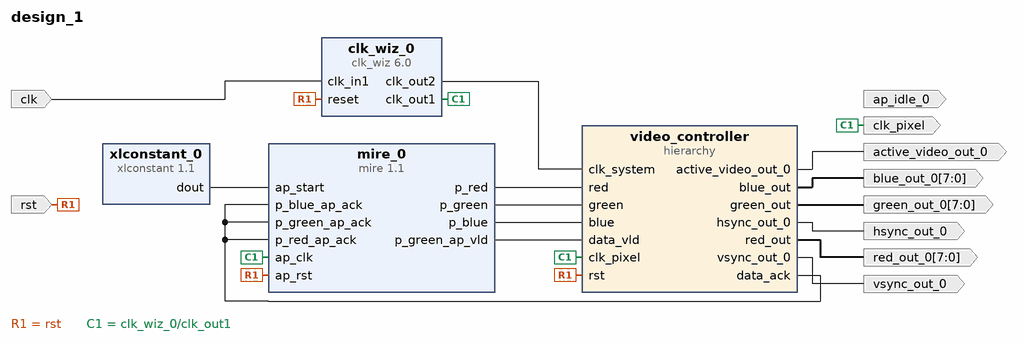
[diagram p0: block diagram of the top level]
# Vivado block design design_1, xc7z020clg484-1, Vivado 2019.2
create_bd_design design_1

create_bd_port -dir I rst
create_bd_port -dir I clk
create_bd_port -dir O vsync_out_0
create_bd_port -dir O hsync_out_0
create_bd_port -dir O -from 7 -to 0 red_out_0
create_bd_port -dir O -from 7 -to 0 green_out_0
create_bd_port -dir O -from 7 -to 0 blue_out_0
create_bd_port -dir O active_video_out_0
create_bd_port -dir O ap_idle_0
create_bd_port -dir O clk_pixel

create_bd_cell -type ip -vlnv xilinx.com:ip:clk_wiz:6.0 clk_wiz_0
set_property -dict [list \
  CONFIG.CLKOUT1_JITTER 191.399 \
  CONFIG.CLKOUT1_PHASE_ERROR 114.212 \
  CONFIG.CLKOUT1_REQUESTED_OUT_FREQ 25.200 \
  CONFIG.CLKOUT2_JITTER 144.719 \
  CONFIG.CLKOUT2_PHASE_ERROR 114.212 \
  CONFIG.CLKOUT2_REQUESTED_OUT_FREQ 100.000 \
  CONFIG.CLKOUT2_USED true \
  CONFIG.MMCM_CLKFBOUT_MULT_F 8.000 \
  CONFIG.MMCM_CLKOUT0_DIVIDE_F 31.750 \
  CONFIG.MMCM_CLKOUT1_DIVIDE 8 \
  CONFIG.MMCM_DIVCLK_DIVIDE 1 \
  CONFIG.NUM_OUT_CLKS 2 \
] [get_bd_cells clk_wiz_0]
create_bd_cell -type hier video_controller
create_bd_cell -type ip -vlnv xilinx.com:hls:mire:1.1 mire_0
create_bd_cell -type ip -vlnv xilinx.com:ip:xlconstant:1.1 xlconstant_0

# ---- hierarchy /video_controller ----
current_bd_instance /video_controller
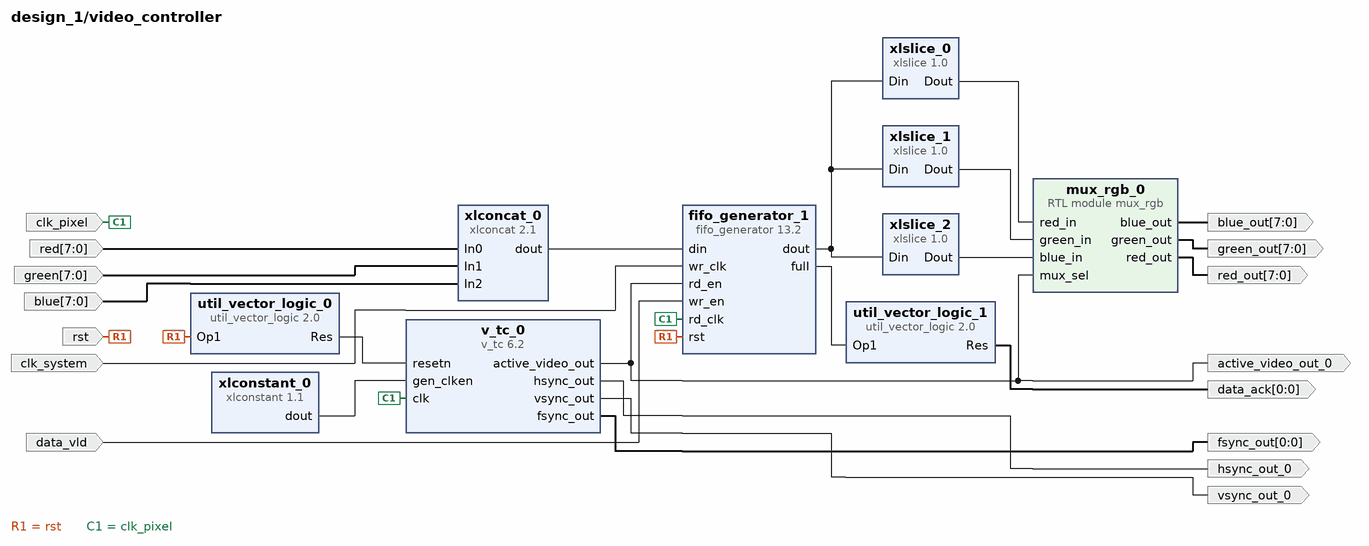
[diagram p1: block diagram inside /video_controller]
create_bd_pin -dir I -from 7 -to 0 red
create_bd_pin -dir I -from 7 -to 0 green
create_bd_pin -dir I -from 7 -to 0 blue
create_bd_pin -dir I rst
create_bd_pin -dir O -from 0 -to 0 data_ack
create_bd_pin -dir I -type clk clk_pixel
create_bd_pin -dir O hsync_out_0
create_bd_pin -dir O vsync_out_0
create_bd_pin -dir O active_video_out_0
create_bd_pin -dir O -from 0 -to 0 fsync_out
create_bd_pin -dir I -type clk clk_system
create_bd_pin -dir I data_vld
create_bd_pin -dir O -from 7 -to 0 red_out
create_bd_pin -dir O -from 7 -to 0 green_out
create_bd_pin -dir O -from 7 -to 0 blue_out

create_bd_cell -type ip -vlnv xilinx.com:ip:xlconcat:2.1 xlconcat_0
set_property -dict [list \
  CONFIG.IN0_WIDTH 8 \
  CONFIG.IN1_WIDTH 8 \
  CONFIG.IN2_WIDTH 8 \
  CONFIG.NUM_PORTS 3 \
  CONFIG.dout_width 24 \
] [get_bd_cells xlconcat_0]
create_bd_cell -type ip -vlnv xilinx.com:ip:util_vector_logic:2.0 util_vector_logic_0
set_property -dict {CONFIG.C_OPERATION not CONFIG.C_SIZE 1} [get_bd_cells util_vector_logic_0]
create_bd_cell -type ip -vlnv xilinx.com:ip:xlconstant:1.1 xlconstant_0
create_bd_cell -type ip -vlnv xilinx.com:ip:util_vector_logic:2.0 util_vector_logic_1
set_property -dict {CONFIG.C_OPERATION not CONFIG.C_SIZE 1} [get_bd_cells util_vector_logic_1]
create_bd_cell -type ip -vlnv xilinx.com:ip:v_tc:6.2 v_tc_0
set_property -dict [list \
  CONFIG.FSYNC_HSTART0 795 \
  CONFIG.HAS_AXI4_LITE false \
  CONFIG.VIDEO_MODE 480p \
  CONFIG.enable_detection false \
  CONFIG.horizontal_blank_generation false \
  CONFIG.vertical_blank_generation false \
] [get_bd_cells v_tc_0]
create_bd_cell -type ip -vlnv xilinx.com:ip:fifo_generator:13.2 fifo_generator_1
set_property -dict [list \
  CONFIG.Enable_Safety_Circuit true \
  CONFIG.FIFO_Implementation_rach Common_Clock_Distributed_RAM \
  CONFIG.FIFO_Implementation_wach Common_Clock_Distributed_RAM \
  CONFIG.FIFO_Implementation_wrch Common_Clock_Distributed_RAM \
  CONFIG.Fifo_Implementation Independent_Clocks_Block_RAM \
  CONFIG.Full_Flags_Reset_Value 1 \
  CONFIG.INTERFACE_TYPE Native \
  CONFIG.Input_Data_Width 24 \
  CONFIG.Input_Depth 32768 \
  CONFIG.Output_Data_Width 24 \
] [get_bd_cells fifo_generator_1]
create_bd_cell -type ip -vlnv xilinx.com:ip:xlslice:1.0 xlslice_0
set_property -dict {CONFIG.DIN_FROM 7 CONFIG.DIN_WIDTH 24 CONFIG.DOUT_WIDTH 8} [get_bd_cells xlslice_0]
create_bd_cell -type ip -vlnv xilinx.com:ip:xlslice:1.0 xlslice_1
set_property -dict {CONFIG.DIN_FROM 15 CONFIG.DIN_TO 8 CONFIG.DIN_WIDTH 24 CONFIG.DOUT_WIDTH 8} [get_bd_cells xlslice_1]
create_bd_cell -type ip -vlnv xilinx.com:ip:xlslice:1.0 xlslice_2
set_property -dict {CONFIG.DIN_FROM 23 CONFIG.DIN_TO 16 CONFIG.DIN_WIDTH 24 CONFIG.DOUT_WIDTH 8} [get_bd_cells xlslice_2]
create_bd_cell -type module -reference mux_rgb mux_rgb_0

# ---- connections ----

current_bd_instance /video_controller
connect_bd_net [get_bd_pins xlconcat_0/dout] [get_bd_pins fifo_generator_1/din]
connect_bd_net [get_bd_pins util_vector_logic_0/Res] [get_bd_pins v_tc_0/resetn]
connect_bd_net [get_bd_pins xlconstant_0/dout] [get_bd_pins v_tc_0/gen_clken]
connect_bd_net [get_bd_pins fifo_generator_1/full] [get_bd_pins util_vector_logic_1/Op1]
connect_bd_net -net mire_0_p_red [get_bd_pins red] [get_bd_pins xlconcat_0/In0]
connect_bd_net -net mire_0_p_green_d0 [get_bd_pins green] [get_bd_pins xlconcat_0/In1]
connect_bd_net -net mire_0_p_blue_d0 [get_bd_pins blue] [get_bd_pins xlconcat_0/In2]
connect_bd_net [get_bd_pins rst] [get_bd_pins util_vector_logic_0/Op1] [get_bd_pins fifo_generator_1/rst]
connect_bd_net -net fifo_generator_0_wr_ack [get_bd_pins util_vector_logic_1/Res] [get_bd_pins data_ack]
connect_bd_net -net clk_wiz_0_clk_out1 [get_bd_pins clk_pixel] [get_bd_pins fifo_generator_1/rd_clk] [get_bd_pins v_tc_0/clk]
connect_bd_net [get_bd_pins v_tc_0/hsync_out] [get_bd_pins hsync_out_0]
connect_bd_net [get_bd_pins v_tc_0/vsync_out] [get_bd_pins vsync_out_0]
connect_bd_net [get_bd_pins v_tc_0/active_video_out] \
  [get_bd_pins active_video_out_0] [get_bd_pins fifo_generator_1/rd_en] [get_bd_pins mux_rgb_0/mux_sel]
connect_bd_net [get_bd_pins v_tc_0/fsync_out] [get_bd_pins fsync_out]
connect_bd_net -net clk_wiz_0_clk_out2 [get_bd_pins clk_system] [get_bd_pins fifo_generator_1/wr_clk]
connect_bd_net -net mire_0_p_red_ap_vld [get_bd_pins data_vld] [get_bd_pins fifo_generator_1/wr_en]
connect_bd_net [get_bd_pins fifo_generator_1/dout] [get_bd_pins xlslice_0/Din] [get_bd_pins xlslice_1/Din] [get_bd_pins xlslice_2/Din]
connect_bd_net [get_bd_pins mux_rgb_0/blue_out] [get_bd_pins blue_out]
connect_bd_net [get_bd_pins mux_rgb_0/green_out] [get_bd_pins green_out]
connect_bd_net [get_bd_pins mux_rgb_0/red_out] [get_bd_pins red_out]
connect_bd_net [get_bd_pins xlslice_0/Dout] [get_bd_pins mux_rgb_0/red_in]
connect_bd_net [get_bd_pins xlslice_1/Dout] [get_bd_pins mux_rgb_0/green_in]
connect_bd_net [get_bd_pins xlslice_2/Dout] [get_bd_pins mux_rgb_0/blue_in]

current_bd_instance /
connect_bd_net [get_bd_ports rst] [get_bd_pins clk_wiz_0/reset] [get_bd_pins video_controller/rst] [get_bd_pins mire_0/ap_rst]
connect_bd_net [get_bd_ports clk] [get_bd_pins clk_wiz_0/clk_in1]
connect_bd_net -net v_tc_0_vsync_out [get_bd_pins video_controller/vsync_out_0] [get_bd_ports vsync_out_0]
connect_bd_net -net v_tc_0_hsync_out [get_bd_pins video_controller/hsync_out_0] [get_bd_ports hsync_out_0]
connect_bd_net [get_bd_pins clk_wiz_0/clk_out1] [get_bd_pins video_controller/clk_pixel] [get_bd_ports clk_pixel] [get_bd_pins mire_0/ap_clk]
connect_bd_net [get_bd_pins clk_wiz_0/clk_out2] [get_bd_pins video_controller/clk_system]
connect_bd_net -net video_controller_Dout_0 [get_bd_pins video_controller/red_out] [get_bd_ports red_out_0]
connect_bd_net -net video_controller_Dout_1 [get_bd_pins video_controller/green_out] [get_bd_ports green_out_0]
connect_bd_net -net video_controller_Dout [get_bd_pins video_controller/blue_out] [get_bd_ports blue_out_0]
connect_bd_net [get_bd_pins video_controller/active_video_out_0] [get_bd_ports active_video_out_0]
connect_bd_net -net red_1 [get_bd_pins mire_0/p_red] [get_bd_pins video_controller/red]
connect_bd_net -net green_1 [get_bd_pins mire_0/p_green] [get_bd_pins video_controller/green]
connect_bd_net -net blue_1 [get_bd_pins mire_0/p_blue] [get_bd_pins video_controller/blue]
connect_bd_net [get_bd_pins video_controller/data_ack] \
  [get_bd_pins mire_0/p_red_ap_ack] [get_bd_pins mire_0/p_green_ap_ack] [get_bd_pins mire_0/p_blue_ap_ack]
connect_bd_net [get_bd_pins mire_0/p_green_ap_vld] [get_bd_pins video_controller/data_vld]
connect_bd_net [get_bd_pins xlconstant_0/dout] [get_bd_pins mire_0/ap_start]

validate_bd_design
save_bd_design
